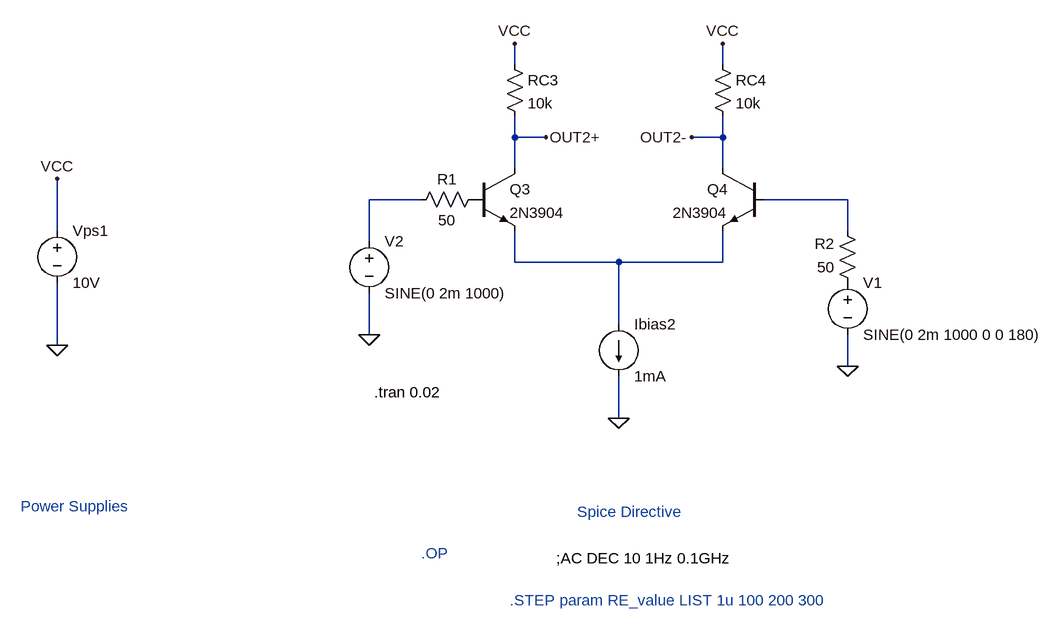
[diagram p0: schematic differential_amplifier_b.asc]
differential_amplifier_b.asc, the LTspice schematic file:
Version 4
SHEET 1 2784 1856
WIRE 1296 176 1296 144
WIRE 1616 176 1616 144
WIRE 1296 288 1296 256
WIRE 1344 288 1296 288
WIRE 1616 288 1616 256
WIRE 1616 288 1568 288
WIRE 1296 336 1296 288
WIRE 1616 336 1616 288
WIRE 1152 384 1072 384
WIRE 1808 384 1680 384
WIRE 592 432 592 352
WIRE 1808 432 1808 384
WIRE 1072 448 1072 384
WIRE 1296 480 1296 432
WIRE 1456 480 1296 480
WIRE 1616 480 1616 432
WIRE 1616 480 1456 480
WIRE 1456 576 1456 480
WIRE 1072 592 1072 528
WIRE 592 608 592 512
WIRE 1808 640 1808 592
WIRE 1456 720 1456 656
FLAG 592 608 0
FLAG 592 352 VCC
FLAG 1344 288 OUT2+
FLAG 1296 144 VCC
FLAG 1616 144 VCC
FLAG 1456 720 0
FLAG 1568 288 OUT2-
FLAG 1072 592 0
FLAG 1808 640 0
SYMBOL voltage 592 416 R0
SYMATTR InstName Vps1
SYMATTR Value 10V
SYMBOL npn 1232 336 R0
SYMATTR InstName Q3
SYMATTR Value 2N3904
SYMBOL npn 1680 336 M0
SYMATTR InstName Q4
SYMATTR Value 2N3904
SYMBOL res 1280 160 R0
SYMATTR InstName RC3
SYMATTR Value 10k
SYMBOL res 1600 160 R0
SYMATTR InstName RC4
SYMATTR Value 10k
SYMBOL current 1456 576 R0
SYMATTR InstName Ibias2
SYMATTR Value 1mA
SYMBOL voltage 1808 496 R0
WINDOW 123 0 0 Left 0
WINDOW 39 0 0 Left 0
SYMATTR InstName V1
SYMATTR Value SINE(0 2m 1000 0 0 180)
SYMBOL voltage 1072 432 R0
WINDOW 123 0 0 Left 0
WINDOW 39 0 0 Left 0
SYMATTR InstName V2
SYMATTR Value SINE(0 2m 1000)
SYMBOL res 1248 368 R90
WINDOW 0 0 56 VBottom 2
WINDOW 3 32 56 VTop 2
SYMATTR InstName R1
SYMATTR Value 50
SYMATTR SpiceLine tol=0.001
SYMBOL res 1824 528 R180
WINDOW 0 36 76 Left 2
WINDOW 3 36 40 Left 2
SYMATTR InstName R2
SYMATTR Value 50
SYMATTR SpiceLine tol=0.001
TEXT 1392 864 Left 2 ;Spice Directive
TEXT 536 856 Left 2 ;Power Supplies
TEXT 1360 936 Left 2 !;AC DEC 10 1Hz 0.1GHz
TEXT 1288 1000 Left 2 ;.STEP param RE_value LIST 1u 100 200 300
TEXT 1152 928 Left 2 ;.OP
TEXT 1080 680 Left 2 !.tran 0.02

The netlist it stands for:
* differential_amplifier_b.asc
Vps1 VCC 0 10V
Q3 OUT2+ P001 N003 0 2N3904
Q4 OUT2- N002 N003 0 2N3904
RC3 VCC OUT2+ 10k
RC4 VCC OUT2- 10k
Ibias2 N003 0 1mA
V1 P002 0 SINE(0 2m 1000 0 0 180)
V2 N001 0 SINE(0 2m 1000)
R1 P001 N001 50 tol=0.001
R2 P002 N002 50 tol=0.001
.model NPN NPN
.model PNP PNP
.lib standard.bjt
* Spice Directive
* Power Supplies
;AC DEC 10 1Hz 0.1GHz
* .STEP param RE_value LIST 1u 100 200 300
* .OP
.tran 0.02
.backanno
.end

* Results of the author's LTspice run, read from the files saved beside the schematic
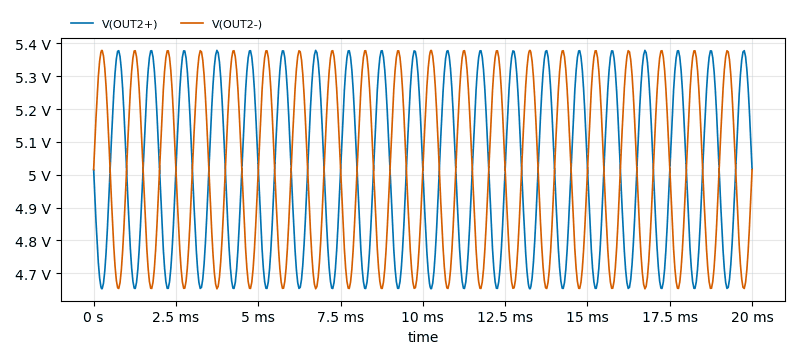
[diagram p1: Transient Analysis of differential_amplifier_b.asc, plotted from the saved traces]
* Transient Analysis, 1 run:
*   V(OUT2+): min 4.653 V, max 5.379 V, average 5.016 V, rms 5.022 V, last 5.016 V
*   V(OUT2-): min 4.653 V, max 5.378 V, average 5.016 V, rms 5.022 V, last 5.016 V